# Altium project nguon.PrjPCB
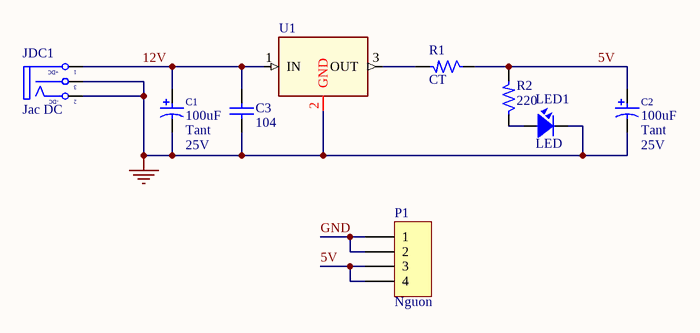
[diagram p0: nguon.SchDoc]
1 sheet, 9 parts. Net scope: global (net labels, ports and power ports of the same name join across sheets).
Board file: nguon.PcbDoc

## Sheet nguon.SchDoc
size A

### Parts
C1  Capacitor Type: Tant  Volt: 25V  [RADIAL B]  (hidden comment: 100uF)
C2  Capacitor Type: Tant  Volt: 25V  [RADIAL B]  (hidden comment: 100uF)
C3  value 104  [Tu-pico]  (hidden comment: Capacitor Ceramic)
JDC1  Jac DC  [DC0]
LED1  LED  [LED-5-RED]
P1  Nguon  [JST-XH_B4B-XH-A]
R1  CT  [R1/8W]
R2  220  [R1/8W]
U1  LM78xx  [TO-220]  (value not drawn)

### Nets
GND: C1.2 C2.2 C3.1 JDC1.2(TN) JDC1.3(S) LED1.2 P1.1 P1.2 U1.2(GND)
5V: C2.1 P1.3 P1.4 R1.1 R2.2
12V: C1.1 C3.2 JDC1.1(T) U1.1(IN)
NetLED1_1: LED1.1 R2.1
NetR1_2: R1.2 U1.3(OUT)

### Notes on the sheet
- (in symbol DCIN) +DC; -DC

### Library data of the parts
C1 C2 = Cap_Pol: Polarized Capacitor; Manufacturer: FARNELL; AEMS Code: 2100110; Vendor: Digikey; Publisher: Hoang Nguyen; Value: 100uF; Published: 13-April-2009; ComponentLink1Description: Digikey Part Link; ComponentLink2Description: Open Datasheet; ComponentLink2URL: H:\LIBRARY\LIBRARY.Datasheet\
C3 = CapCeramic: Capacitor; Published: 8-Jun-2000; LatestRevisionDate: 17-Jul-2002; LatestRevisionNote: Re-released for DXP Platform.; PackageReference: RAD-0.3; Publisher: Altium Limited
JDC1 = DCIN: Jac DC input; Value: Jac DC
LED1 = LED: LED Single colour Green and Red; Value: LED 3 ly Single Colour
P1 = Connector_4pin
R1 R2 = R: Resistor 1/4W; Value: R1/4W - 1K
U1 = 78xx: Regulator; Manufacturer: Fairchild Semiconductor Corporation; PSpiceTemplate: X^@REFDES %IN %OUT %GND @MODEL; Vendor: Digikey; Output Current: Up to 1A; V out: 5V; Tolerance: 4 %; Value: LM7805CT; Published: 13-April-2009; Publisher: Hoang Nguyen; ComponentLink1Description: Digikey Part Link; ComponentLink2Description: Open Datasheet; ComponentLink2URL: H:\LIBRARY\LIBRARY.Datasheet\LM7805.pdf; Price: 2500 VND